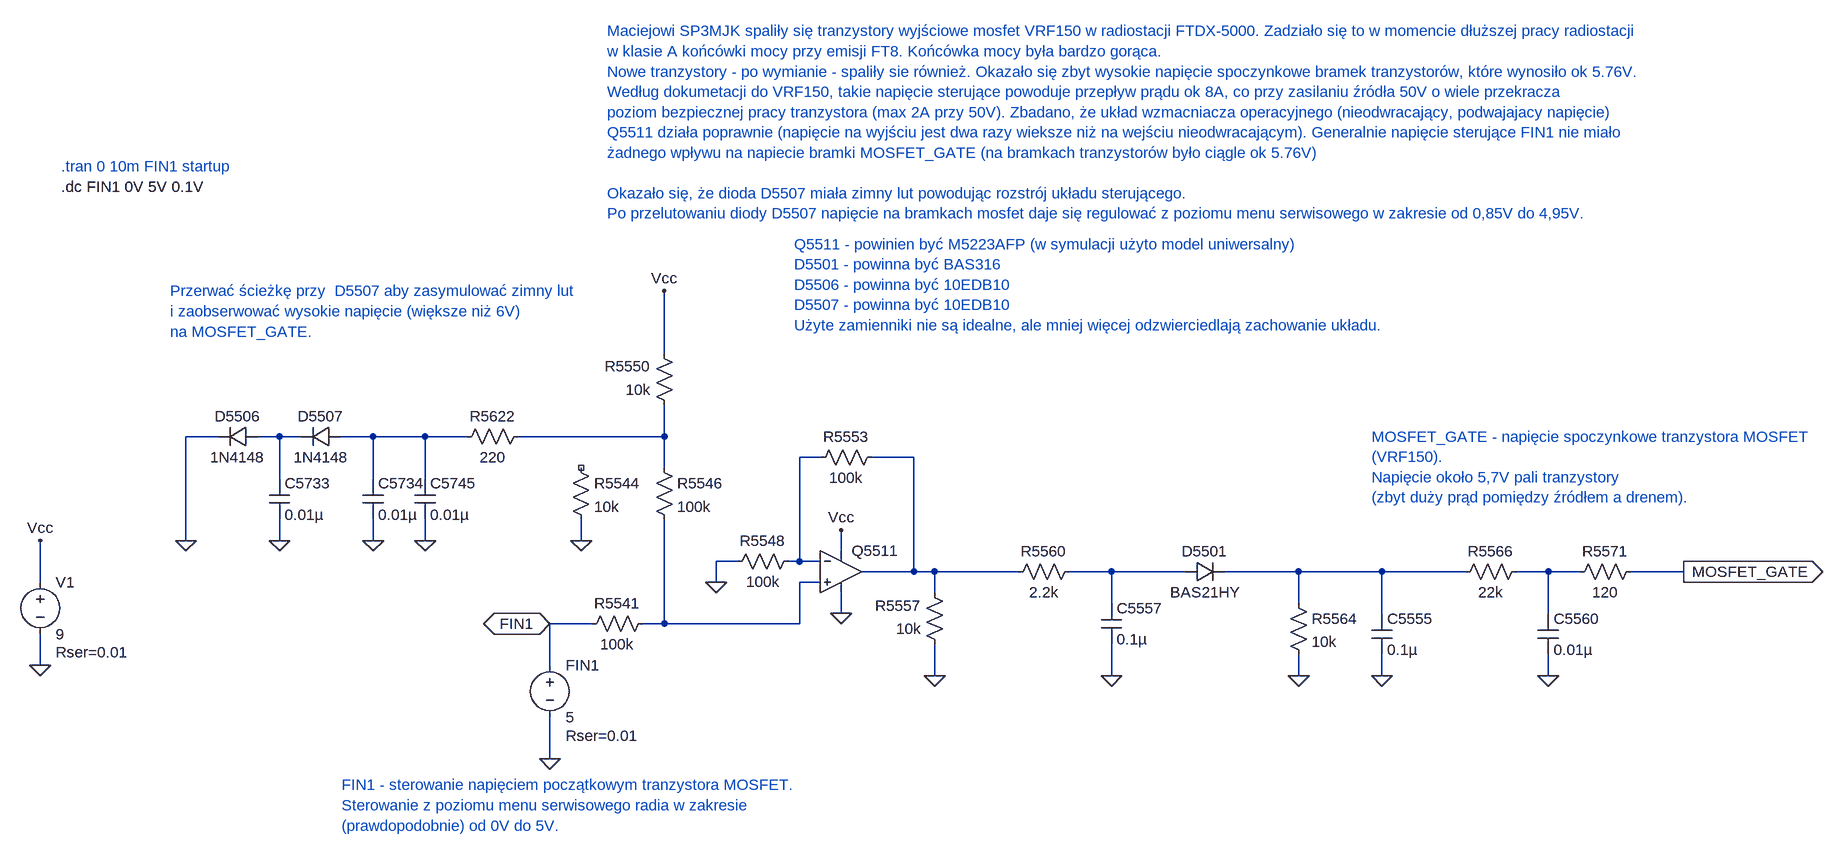
[diagram p0: schematic sp3mjk_power_amplifier.asc]
sp3mjk_power_amplifier.asc, the LTspice schematic file:
Version 4
SHEET 1 1856 680
WIRE 0 -208 0 -304
WIRE -688 -80 -736 -80
WIRE -592 -80 -624 -80
WIRE -560 -80 -592 -80
WIRE -448 -80 -496 -80
WIRE -368 -80 -448 -80
WIRE -304 -80 -368 -80
WIRE 0 -80 0 -128
WIRE 0 -80 -224 -80
WIRE 240 -48 208 -48
WIRE 384 -48 320 -48
WIRE 0 -32 0 -80
WIRE -592 -16 -592 -80
WIRE -448 -16 -448 -80
WIRE -368 -16 -368 -80
WIRE -736 80 -736 -80
WIRE -592 80 -592 48
WIRE -448 80 -448 48
WIRE -368 80 -368 48
WIRE -128 80 -128 48
WIRE 272 96 272 64
WIRE 112 112 80 112
WIRE 208 112 208 -48
WIRE 208 112 192 112
WIRE 240 112 208 112
WIRE 384 128 384 -48
WIRE 384 128 304 128
WIRE 416 128 384 128
WIRE 544 128 416 128
WIRE 688 128 624 128
WIRE 800 128 688 128
WIRE 976 128 864 128
WIRE 1104 128 976 128
WIRE 1232 128 1104 128
WIRE 1360 128 1312 128
WIRE 1408 128 1360 128
WIRE 1568 128 1488 128
WIRE -960 144 -960 80
WIRE 80 144 80 112
WIRE 240 144 208 144
WIRE 416 160 416 128
WIRE 688 176 688 128
WIRE 976 176 976 128
WIRE 272 192 272 160
WIRE 1104 192 1104 128
WIRE 1360 192 1360 128
WIRE -112 208 -176 208
WIRE 0 208 0 48
WIRE 0 208 -32 208
WIRE 208 208 208 144
WIRE 208 208 0 208
WIRE -960 272 -960 224
WIRE -176 272 -176 208
WIRE 416 288 416 240
WIRE 688 288 688 240
WIRE 976 288 976 256
WIRE 1104 288 1104 256
WIRE 1360 288 1360 256
WIRE -176 416 -176 352
FLAG -960 272 0
FLAG 272 192 0
FLAG 80 144 0
FLAG -128 80 0
FLAG -176 416 0
FLAG 416 288 0
FLAG 688 288 0
FLAG -960 80 Vcc
FLAG 272 64 Vcc
FLAG 0 -304 Vcc
FLAG 976 288 0
FLAG 1104 288 0
FLAG 1360 288 0
FLAG -368 80 0
FLAG -448 80 0
FLAG -592 80 0
FLAG -736 80 0
FLAG 1568 128 MOSFET_GATE
IOPIN 1568 128 Out
FLAG -176 208 FIN1
IOPIN -176 208 BiDir
SYMBOL OpAmps\\UniversalOpAmp 272 128 R0
SYMATTR InstName Q5511
SYMBOL voltage -960 128 R0
WINDOW 123 0 0 Left 0
WINDOW 39 24 124 Left 2
SYMATTR SpiceLine Rser=0.01
SYMATTR InstName V1
SYMATTR Value 9
SYMBOL res 208 96 R90
WINDOW 0 0 56 VBottom 2
WINDOW 3 32 56 VTop 2
SYMATTR InstName R5548
SYMATTR Value 100k
SYMBOL res 336 -64 R90
WINDOW 0 0 56 VBottom 2
WINDOW 3 32 56 VTop 2
SYMATTR InstName R5553
SYMATTR Value 100k
SYMBOL res 432 256 R180
WINDOW 0 36 76 Left 2
WINDOW 3 36 40 Left 2
SYMATTR InstName R5557
SYMATTR Value 10k
SYMBOL res -16 192 R90
WINDOW 0 0 56 VBottom 2
WINDOW 3 32 56 VTop 2
SYMATTR InstName R5541
SYMATTR Value 100k
SYMBOL res -16 -48 R0
SYMATTR InstName R5546
SYMATTR Value 100k
SYMBOL res -144 -48 R0
SYMATTR InstName R5544
SYMATTR Value 10k
SYMBOL res 16 -112 R180
WINDOW 0 36 76 Left 2
WINDOW 3 36 40 Left 2
SYMATTR InstName R5550
SYMATTR Value 10k
SYMBOL res 640 112 R90
WINDOW 0 0 56 VBottom 2
WINDOW 3 32 56 VTop 2
SYMATTR InstName R5560
SYMATTR Value 2.2k
SYMBOL cap 672 176 R0
SYMATTR InstName C5557
SYMATTR Value 0.1µ
SYMBOL diode 800 144 R270
WINDOW 0 32 32 VTop 2
WINDOW 3 0 32 VBottom 2
SYMATTR InstName D5501
SYMATTR Value BAS21HY
SYMBOL res 960 160 R0
SYMATTR InstName R5564
SYMATTR Value 10k
SYMBOL cap 1088 192 R0
SYMATTR InstName C5555
SYMATTR Value 0.1µ
SYMBOL res 1328 112 R90
WINDOW 0 0 56 VBottom 2
WINDOW 3 32 56 VTop 2
SYMATTR InstName R5566
SYMATTR Value 22k
SYMBOL res 1504 112 R90
WINDOW 0 0 56 VBottom 2
WINDOW 3 32 56 VTop 2
SYMATTR InstName R5571
SYMATTR Value 120
SYMBOL cap 1344 192 R0
SYMATTR InstName C5560
SYMATTR Value 0.01µ
SYMBOL voltage -176 256 R0
WINDOW 123 0 0 Left 0
WINDOW 39 24 124 Left 2
SYMATTR SpiceLine Rser=0.01
SYMATTR InstName FIN1
SYMATTR Value 5
SYMBOL res -208 -96 R90
WINDOW 0 0 56 VBottom 2
WINDOW 3 32 56 VTop 2
SYMATTR InstName R5622
SYMATTR Value 220
SYMBOL cap -384 -16 R0
SYMATTR InstName C5745
SYMATTR Value 0.01µ
SYMBOL cap -464 -16 R0
SYMATTR InstName C5734
SYMATTR Value 0.01µ
SYMBOL diode -496 -96 R90
WINDOW 0 0 32 VBottom 2
WINDOW 3 32 32 VTop 2
SYMATTR InstName D5507
SYMATTR Value 1N4148
SYMBOL diode -624 -96 R90
WINDOW 0 0 32 VBottom 2
WINDOW 3 32 32 VTop 2
SYMATTR InstName D5506
SYMATTR Value 1N4148
SYMBOL cap -608 -16 R0
SYMATTR InstName C5733
SYMATTR Value 0.01µ
TEXT -928 -496 Left 2 ;.tran 0 10m FIN1 startup
TEXT -928 -464 Left 2 !.dc FIN1 0V 5V 0.1V
TEXT -760 -304 Left 2 ;Przerwać ścieżkę przy  D5507 aby zasymulować zimny lut \ni zaobserwować wysokie napięcie (większe niż 6V)\nna MOSFET_GATE.
TEXT -496 456 Left 2 ;FIN1 - sterowanie napięciem początkowym tranzystora MOSFET.\nSterowanie z poziomu menu serwisowego radia w zakresie\n(prawdopodobnie) od 0V do 5V.
TEXT 1088 -80 Left 2 ;MOSFET_GATE - napięcie spoczynkowe tranzystora MOSFET\n(VRF150).\nNapięcie około 5,7V pali tranzystory \n(zbyt duży prąd pomiędzy źródłem a drenem).
TEXT 200 -376 Left 2 ;Q5511 - powinien być M5223AFP (w symulacji użyto model uniwersalny)\nD5501 - powinna być BAS316\nD5506 - powinna być 10EDB10\nD5507 - powinna być 10EDB10\nUżyte zamienniki nie są idealne, ale mniej więcej odzwierciedlają zachowanie układu.
TEXT -88 -704 Left 2 ;Maciejowi SP3MJK spaliły się tranzystory wyjściowe mosfet VRF150 w radiostacji FTDX-5000. Zadziało się to w momencie dłuższej pracy radiostacji \nw klasie A końcówki mocy przy emisji FT8. Końcówka mocy była bardzo gorąca.\nNowe tranzystory - po wymianie - spaliły sie również. Okazało się zbyt wysokie napięcie spoczynkowe bramek tranzystorów, które wynosiło ok 5.76V.\nWedług dokumetacji do VRF150, takie napięcie sterujące powoduje przepływ prądu ok 8A, co przy zasilaniu źródła 50V o wiele przekracza\npoziom bezpiecznej pracy tranzystora (max 2A przy 50V). Zbadano, że układ wzmacniacza operacyjnego (nieodwracający, podwajajacy napięcie)\nQ5511 działa poprawnie (napięcie na wyjściu jest dwa razy wieksze niż na wejściu nieodwracającym). Generalnie napięcie sterujące FIN1 nie miało\nżadnego wpływu na napiecie bramki MOSFET_GATE (na bramkach tranzystorów było ciągle ok 5.76V)\n \nOkazało się, że dioda D5507 miała zimny lut powodując rozstrój układu sterującego.\nPo przelutowaniu diody D5507 napięcie na bramkach mosfet daje się regulować z poziomu menu serwisowego w zakresie od 0,85V do 4,95V.

The netlist it stands for:
* sp3mjk_power_amplifier.asc
XQ5511 N009 N004 Vcc 0 N005 level1 Avol=1Meg GBW=10Meg Vos=0 En=0 Enk=0 In=0 Ink=0 Rin=500Meg  ; pins In+ In- V+ V- OUT
V1 Vcc 0 9 Rser=0.01
R5548 N004 0 100k
R5553 N005 N004 100k
R5557 0 N005 10k
R5541 N009 FIN1 100k
R5546 N003 N009 100k
R5544 NC_01 0 10k
R5550 N003 Vcc 10k
R5560 N006 N005 2.2k
C5557 N006 0 0.1µ
D5501 N006 N007 BAS21HY
R5564 N007 0 10k
C5555 N007 0 0.1µ
R5566 N008 N007 22k
R5571 MOSFET_GATE N008 120
C5560 N008 0 0.01µ
V§FIN1 FIN1 0 5 Rser=0.01
R5622 N003 N002 220
C5745 N002 0 0.01µ
C5734 N002 0 0.01µ
D5507 N002 N001 1N4148
D5506 N001 0 1N4148
C5733 N001 0 0.01µ
.model D D
.lib standard.dio
* .tran 0 10m FIN1 startup
.dc FIN1 0V 5V 0.1V
* Przerwać ścieżkę przy  D5507 aby zasymulować zimny lut
* i zaobserwować wysokie napięcie (większe niż 6V)
* na MOSFET_GATE.
* FIN1 - sterowanie napięciem początkowym tranzystora MOSFET.
* Sterowanie z poziomu menu serwisowego radia w zakresie
* (prawdopodobnie) od 0V do 5V.
* MOSFET_GATE - napięcie spoczynkowe tranzystora MOSFET
* (VRF150).
* Napięcie około 5,7V pali tranzystory
* (zbyt duży prąd pomiędzy źródłem a drenem).
* Q5511 - powinien być M5223AFP (w symulacji użyto model uniwersalny)
* D5501 - powinna być BAS316
* D5506 - powinna być 10EDB10
* D5507 - powinna być 10EDB10
* Użyte zamienniki nie są idealne, ale mniej więcej odzwierciedlają zachowanie układu.
* Maciejowi SP3MJK spaliły się tranzystory wyjściowe mosfet VRF150 w radiostacji FTDX-5000. Zadziało się to w momencie dłuższej pracy radiostacji
* w klasie A końcówki mocy przy emisji FT8. Końcówka mocy była bardzo gorąca.
* Nowe tranzystory - po wymianie - spaliły sie również. Okazało się zbyt wysokie napięcie spoczynkowe bramek tranzystorów, które wynosiło ok 5.76V.
* Według dokumetacji do VRF150, takie napięcie sterujące powoduje przepływ prądu ok 8A, co przy zasilaniu źródła 50V o wiele przekracza
* poziom bezpiecznej pracy tranzystora (max 2A przy 50V). Zbadano, że układ wzmacniacza operacyjnego (nieodwracający, podwajajacy napięcie)
* Q5511 działa poprawnie (napięcie na wyjściu jest dwa razy wieksze niż na wejściu nieodwracającym). Generalnie napięcie sterujące FIN1 nie miało
* żadnego wpływu na napiecie bramki MOSFET_GATE (na bramkach tranzystorów było ciągle ok 5.76V)
* Okazało się, że dioda D5507 miała zimny lut powodując rozstrój układu sterującego.
* Po przelutowaniu diody D5507 napięcie na bramkach mosfet daje się regulować z poziomu menu serwisowego w zakresie od 0,85V do 4,95V.
.lib UniversalOpAmp1.lib
.backanno
.end